# EAGLE board loa (EAGLE 5.11), part 1 of 2
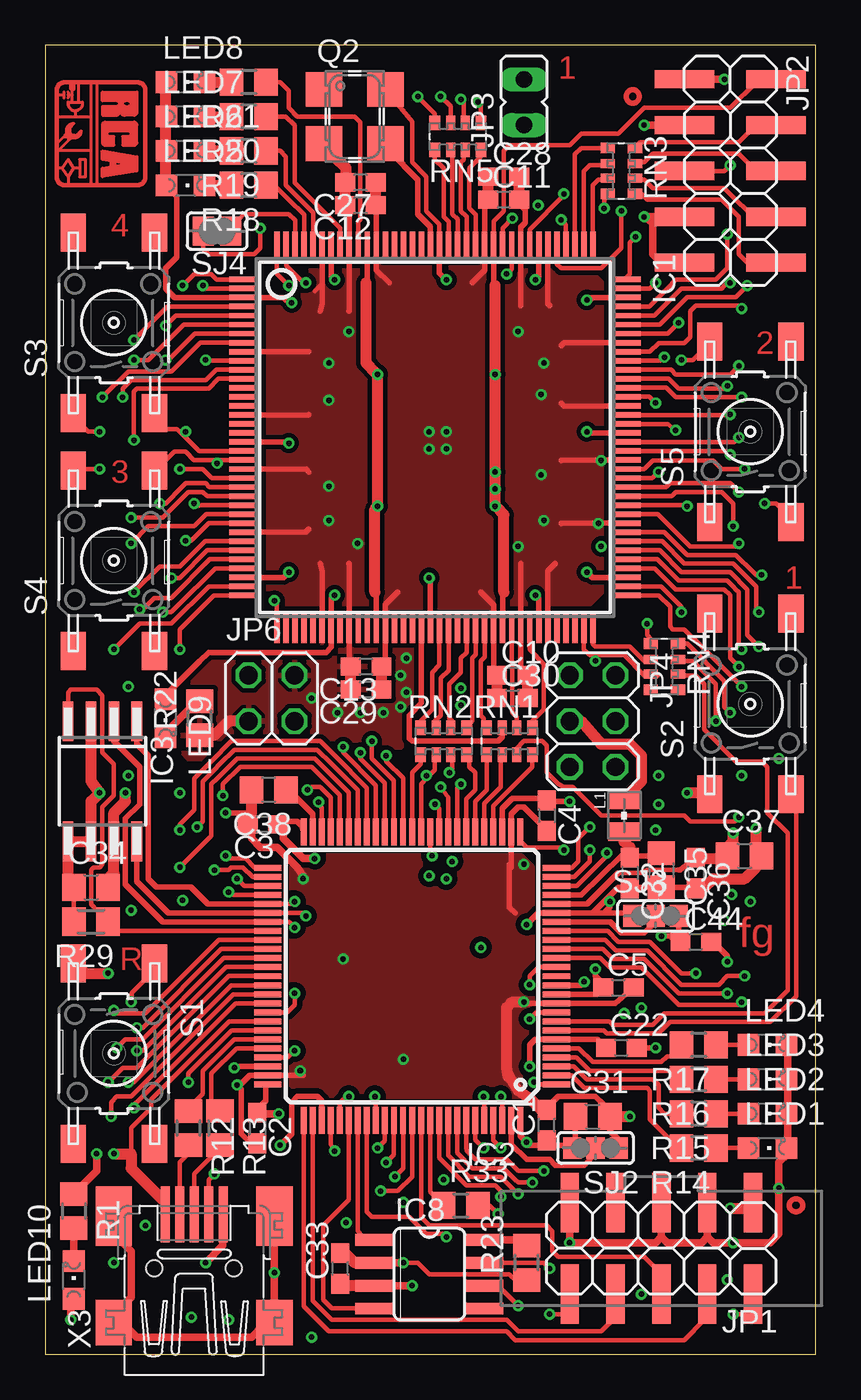
[diagram p7: board, top side]
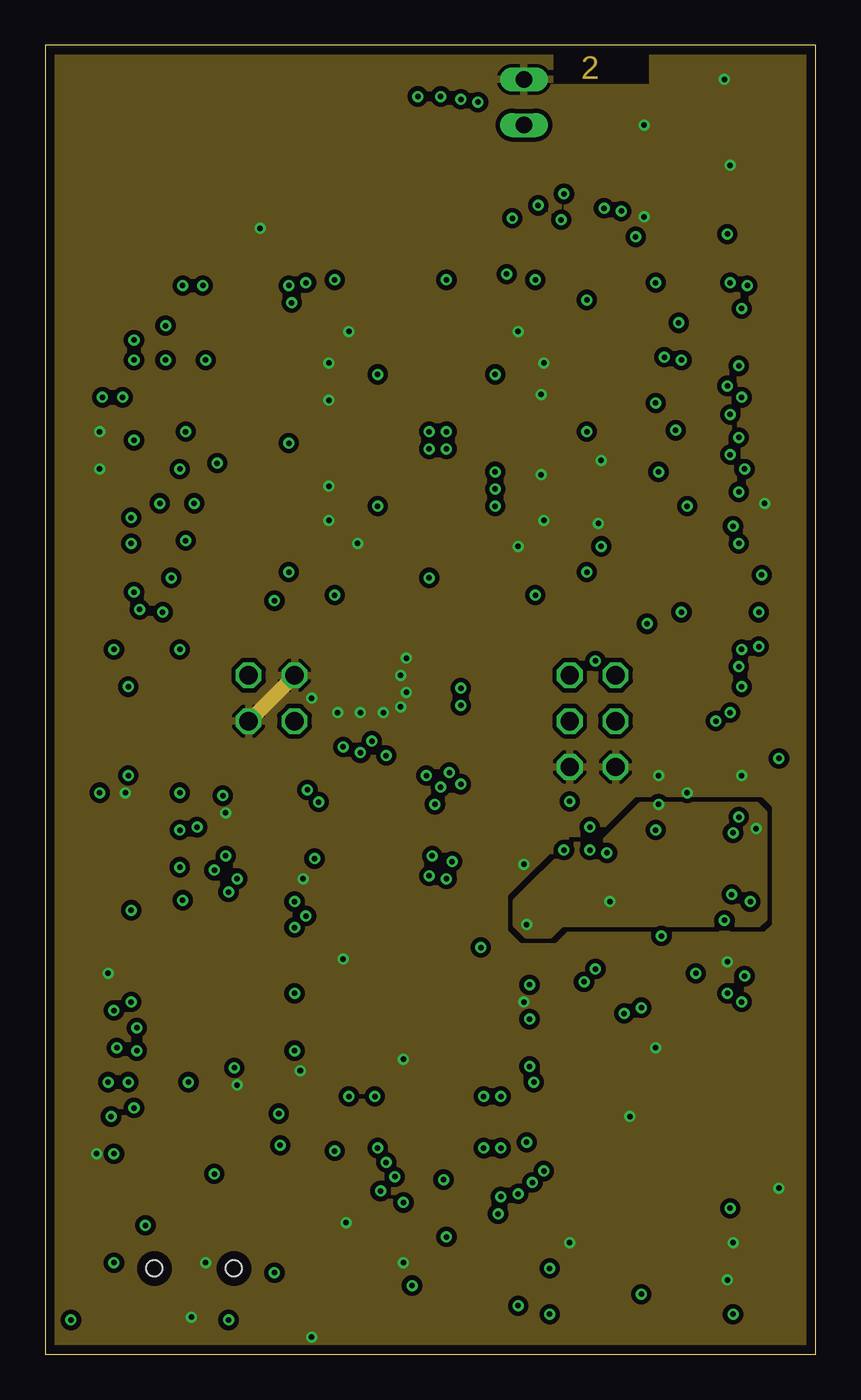
[diagram p8: board, inner layer GND]
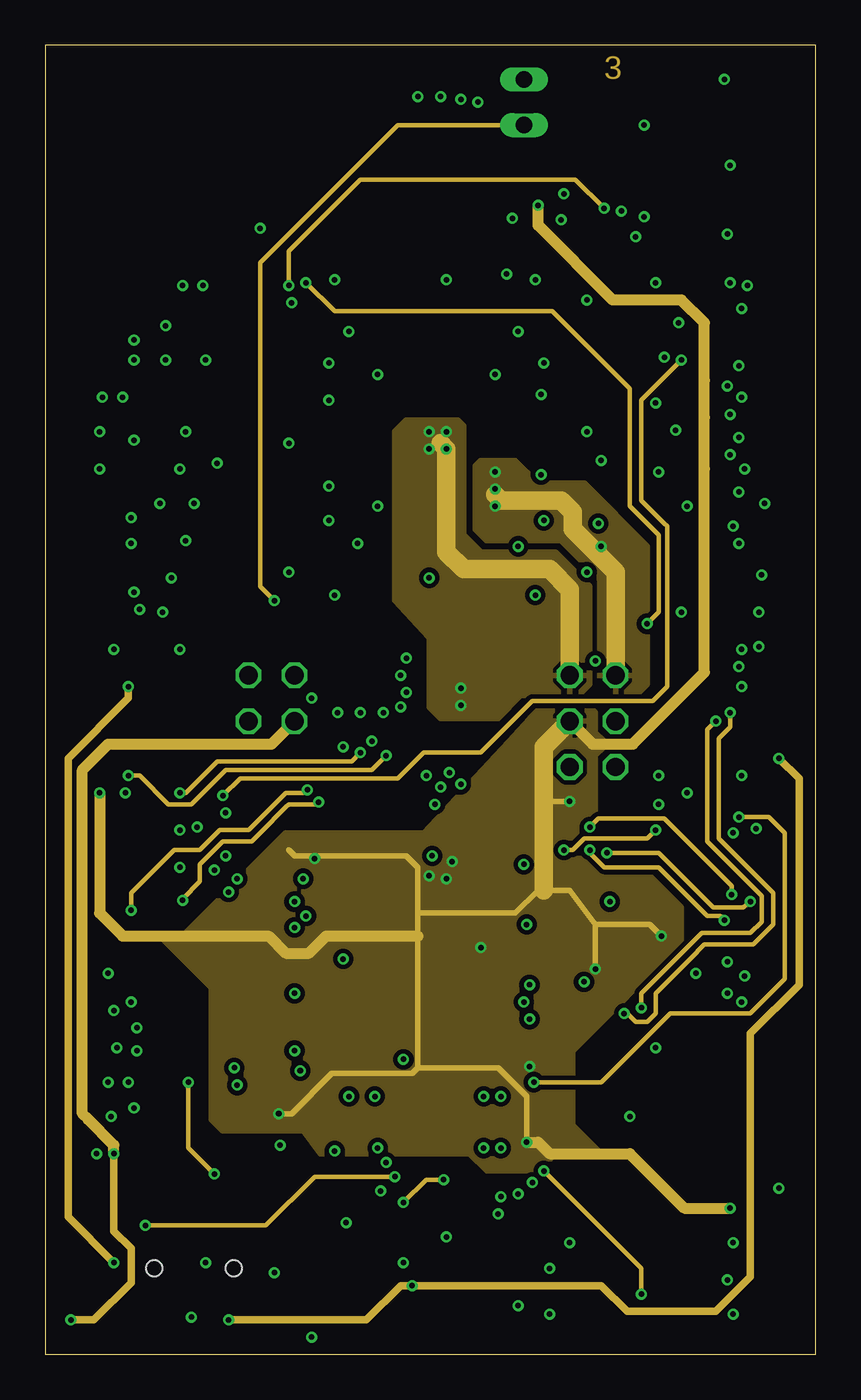
[diagram p9: board, inner layer Route15]
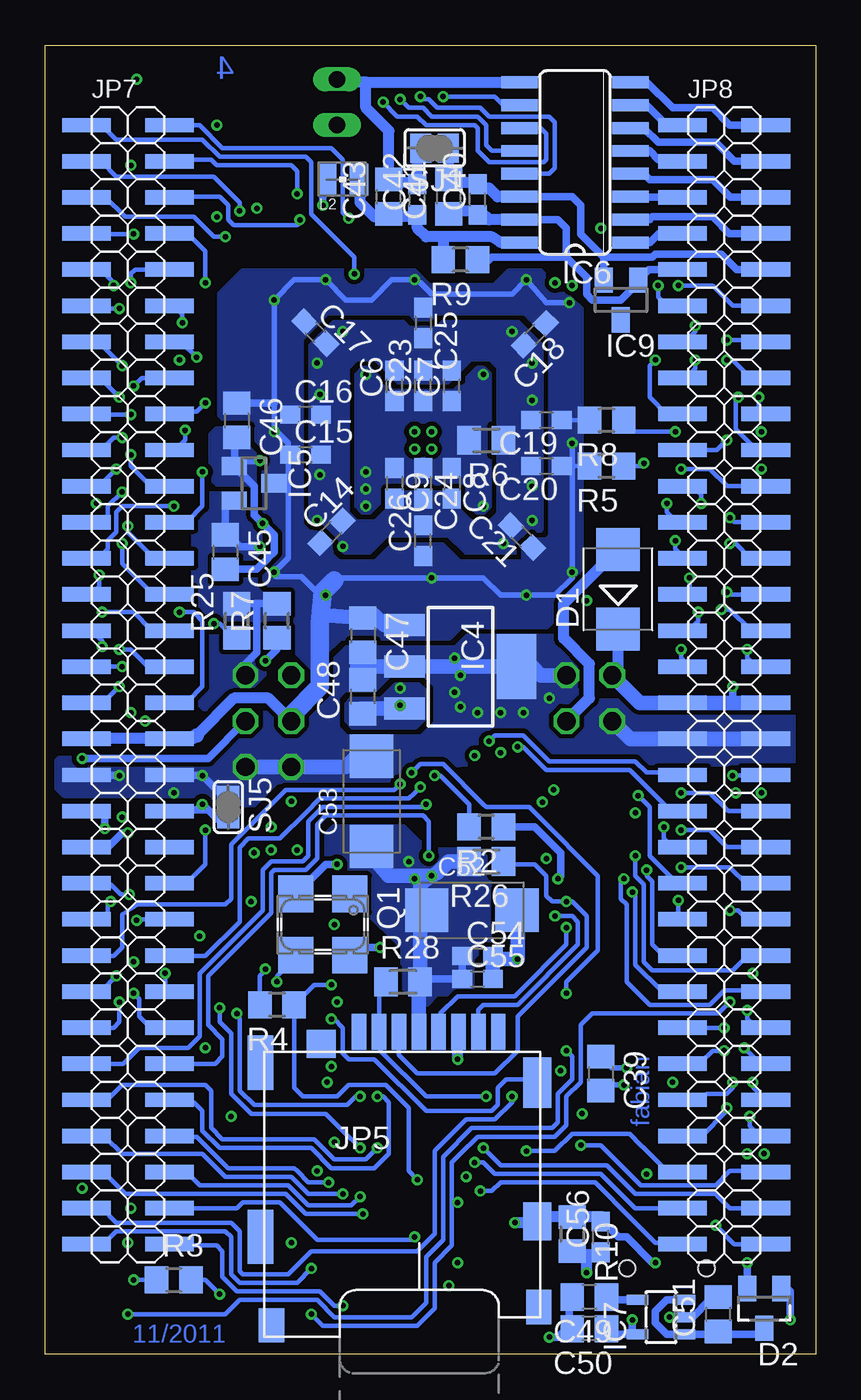
[diagram p10: board, bottom side, seen from below]

Size 42.68 x 72.54 mm. Coordinates in mm from the lower left corner, seen from the top.
Outline: 0,0 42.68,0 42.68,72.54 0,72.54 0,0
Copper layers (1+2*15+16): Top 0.035mm / dielectric 1.5mm / GND 0.035mm / dielectric 0.15mm / Route15 0.035mm / dielectric 0.2mm / Bottom 0.035mm
Design rules "PCB-POOL *": minimum track width 6mil, minimum drill 12mil, track to track 6mil, track to pad 6mil, pad to pad 6mil, via to via 6mil, smd to smd 6mil, copper to edge 20mil, drill to drill 8mil, minimum pad ring 8mil, minimum via ring 6mil, stop-mask expansion 12mil, vias tented up to drill 12mil, thermal gap 8mil

## Footprints (pad centres in the part's own frame; a part is rotated, then mirrored left to right if it is on the bottom)
C0603 = smd 1.1 x 1: 1 -0.85,0; 2 0.85,0
C0805 = smd 1.3 x 1.5: 1 -0.95,0; 2 0.95,0
SMC_C = smd 2.4 x 2.4: + -2.5,0; - 2.5,0
SMB = smd 2.4 x 2.4: A 2.2,0; C -2.2,0
SOT23 = smd 1 x 1.4: 1 -0.95,-1.1; 2 0.95,-1.1; 3 0,1.1
TQ144 = smd 0.3 x 1.6: 1 -8.75,-10.6; 2 -8.25,-10.6; 3 -7.75,-10.6; 4 -7.25,-10.6; 5 -6.75,-10.6; 6 -6.25,-10.6; 7 -5.75,-10.6; 8 -5.25,-10.6; 9 -4.75,-10.6; 10 -4.25,-10.6; 11 -3.75,-10.6; 12 -3.25,-10.6; 13 -2.75,-10.6; 14 -2.25,-10.6; 15 -1.75,-10.6; 16 -1.25,-10.6; 17 -0.75,-10.6; 18 -0.25,-10.6; 19 0.25,-10.6; 20 0.75,-10.6; 21 1.25,-10.6; 22 1.75,-10.6; 23 2.25,-10.6; 24 2.75,-10.6; 25 3.25,-10.6; 26 3.75,-10.6; 27 4.25,-10.6; 28 4.75,-10.6; 29 5.25,-10.6; 30 5.75,-10.6; 31 6.25,-10.6; 32 6.75,-10.6; 33 7.25,-10.6; 34 7.75,-10.6; 35 8.25,-10.6; 36 8.75,-10.6; 73 8.75,10.6; 74 8.25,10.6; 75 7.75,10.6; 76 7.25,10.6; 77 6.75,10.6; 78 6.25,10.6; 79 5.75,10.6; 80 5.25,10.6; 81 4.75,10.6; 82 4.25,10.6; 83 3.75,10.6; 84 3.25,10.6; 85 2.75,10.6; 86 2.25,10.6; 87 1.75,10.6; 88 1.25,10.6; 89 0.75,10.6; 90 0.25,10.6; 91 -0.25,10.6; 92 -0.75,10.6; 93 -1.25,10.6; 94 -1.75,10.6; 95 -2.25,10.6; 96 -2.75,10.6; 97 -3.25,10.6; 98 -3.75,10.6; 99 -4.25,10.6; 100 -4.75,10.6; 101 -5.25,10.6; 102 -5.75,10.6; 103 -6.25,10.6; 104 -6.75,10.6; 105 -7.25,10.6; 106 -7.75,10.6; 107 -8.25,10.6; 108 -8.75,10.6 | smd 1.6 x 0.3: 37 10.6,-8.75; 38 10.6,-8.25; 39 10.6,-7.75; 40 10.6,-7.25; 41 10.6,-6.75; 42 10.6,-6.25; 43 10.6,-5.75; 44 10.6,-5.25; 45 10.6,-4.75; 46 10.6,-4.25; 47 10.6,-3.75; 48 10.6,-3.25; 49 10.6,-2.75; 50 10.6,-2.25; 51 10.6,-1.75; 52 10.6,-1.25; 53 10.6,-0.75; 54 10.6,-0.25; 55 10.6,0.25; 56 10.6,0.75; 57 10.6,1.25; 58 10.6,1.75; 59 10.6,2.25; 60 10.6,2.75; 61 10.6,3.25; 62 10.6,3.75; 63 10.6,4.25; 64 10.6,4.75; 65 10.6,5.25; 66 10.6,5.75; 67 10.6,6.25; 68 10.6,6.75; 69 10.6,7.25; 70 10.6,7.75; 71 10.6,8.25; 72 10.6,8.75; 109 -10.6,8.75; 110 -10.6,8.25; 111 -10.6,7.75; 112 -10.6,7.25; 113 -10.6,6.75; 114 -10.6,6.25; 115 -10.6,5.75; 116 -10.6,5.25; 117 -10.6,4.75; 118 -10.6,4.25; 119 -10.6,3.75; 120 -10.6,3.25; 121 -10.6,2.75; 122 -10.6,2.25; 123 -10.6,1.75; 124 -10.6,1.25; 125 -10.6,0.75; 126 -10.6,0.25; 127 -10.6,-0.25; 128 -10.6,-0.75; 129 -10.6,-1.25; 130 -10.6,-1.75; 131 -10.6,-2.25; 132 -10.6,-2.75; 133 -10.6,-3.25; 134 -10.6,-3.75; 135 -10.6,-4.25; 136 -10.6,-4.75; 137 -10.6,-5.25; 138 -10.6,-5.75; 139 -10.6,-6.25; 140 -10.6,-6.75; 141 -10.6,-7.25; 142 -10.6,-7.75; 143 -10.6,-8.25; 144 -10.6,-8.75
TQFP100 = smd 1.5 x 0.33: 1 -8,6; 2 -8,5.5; 3 -8,5; 4 -8,4.5; 5 -8,4; 6 -8,3.5; 7 -8,3; 8 -8,2.5; 9 -8,2; 10 -8,1.5; 11 -8,1; 12 -8,0.5; 13 -8,0; 14 -8,-0.5; 15 -8,-1; 16 -8,-1.5; 17 -8,-2; 18 -8,-2.5; 19 -8,-3; 20 -8,-3.5; 21 -8,-4; 22 -8,-4.5; 23 -8,-5; 24 -8,-5.5; 25 -8,-6; 51 8,-6; 52 8,-5.5; 53 8,-5; 54 8,-4.5; 55 8,-4; 56 8,-3.5; 57 8,-3; 58 8,-2.5; 59 8,-2; 60 8,-1.5; 61 8,-1; 62 8,-0.5; 63 8,0; 64 8,0.5; 65 8,1; 66 8,1.5; 67 8,2; 68 8,2.5; 69 8,3; 70 8,3.5; 71 8,4; 72 8,4.5; 73 8,5; 74 8,5.5; 75 8,6 | smd 0.33 x 1.5: 26 -6,-8; 27 -5.5,-8; 28 -5,-8; 29 -4.5,-8; 30 -4,-8; 31 -3.5,-8; 32 -3,-8; 33 -2.5,-8; 34 -2,-8; 35 -1.5,-8; 36 -1,-8; 37 -0.5,-8; 38 0,-8; 39 0.5,-8; 40 1,-8; 41 1.5,-8; 42 2,-8; 43 2.5,-8; 44 3,-8; 45 3.5,-8; 46 4,-8; 47 4.5,-8; 48 5,-8; 49 5.5,-8; 50 6,-8; 76 6,8; 77 5.5,8; 78 5,8; 79 4.5,8; 80 4,8; 81 3.5,8; 82 3,8; 83 2.5,8; 84 2,8; 85 1.5,8; 86 1,8; 87 0.5,8; 88 0,8; 89 -0.5,8; 90 -1,8; 91 -1.5,8; 92 -2,8; 93 -2.5,8; 94 -3,8; 95 -3.5,8; 96 -4,8; 97 -4.5,8; 98 -5,8; 99 -5.5,8; 100 -6,8
SO-08M = smd 0.6 x 2.2: 1 -1.905,-3.33; 2 -0.635,-3.33; 3 0.635,-3.33; 4 1.905,-3.33; 5 1.905,3.33; 6 0.635,3.33; 7 -0.635,3.33; 8 -1.905,3.33
SOT223 = smd 1.219 x 2.235: 1 -2.311,-3.099; 2 0,-3.099; 3 2.311,-3.099 | smd 3.6 x 2.2: 4 0,3.099
SO16 = smd 0.66 x 2.032: 1 -4.445,-3.073; 2 -3.175,-3.073; 3 -1.905,-3.073; 4 -0.635,-3.073; 5 0.635,-3.073; 6 1.905,-3.073; 7 3.175,-3.073; 8 4.445,-3.073; 9 4.445,3.073; 10 3.175,3.073; 11 1.905,3.073; 12 0.635,3.073; 13 -0.635,3.073; 14 -1.905,3.073; 15 -3.175,3.073; 16 -4.445,3.073
SOT23-5L = smd 0.55 x 1.2: 1 -0.95,-1.3; 2 0,-1.3; 3 0.95,-1.3; 4 0.95,1.3; 5 -0.95,1.3
SOIC-8 = smd 2.032 x 0.66: 1 -3.073,1.27; 2 -3.073,0; 3 -3.073,-1.27; 4 -3.073,-2.54; 5 3.073,-2.54; 6 3.073,-1.27; 7 3.073,0; 8 3.073,1.27
2X05SMD = smd 1.016 x 3.302: 1 -5.08,-2.54; 2 -5.08,2.54; 3 -2.54,-2.54; 4 -2.54,2.54; 5 0,-2.54; 6 0,2.54; 7 2.54,-2.54; 8 2.54,2.54; 9 5.08,-2.54; 10 5.08,2.54
2X05SMD' = smd 1.016 x 3.302: 1 -1.27,-3.81; 2 -1.27,1.27; 3 1.27,-3.81; 4 1.27,1.27; 5 3.81,-3.81; 6 3.81,1.27; 7 6.35,-3.81; 8 6.35,1.27; 9 8.89,-3.81; 10 8.89,1.27
JP1 = drill 0.914 long: 1 0,-1.27; 2 0,1.27
2X03 = drill 1.016 octagon: 1 -2.54,-1.27; 2 -2.54,1.27; 3 0,-1.27; 4 0,1.27; 5 2.54,-1.27; 6 2.54,1.27
SD_MOLEX_49225-0821 = smd 0.8 x 2: 1 -2.43,8.5; 2 -1.33,8.5; 3 -0.23,8.5; 4 0.87,8.5; 5 1.97,8.5; 6 3.07,8.5; 7 4.17,8.5; 8 5.27,8.5 | smd 1.4 x 1.9: 11 7.51,-6.75; 12 -7.29,-7.75 | smd 1.4 x 3: 13 -7.89,-2.85; 14 -7.89,6.8 | smd 1.6 x 1.55: 15 -4.53,7.825 | smd 1.55 x 2.8: SW1 7.435,5.7 | smd 1.55 x 2.1: SW2 7.435,-2
2X02 = drill 1.016 octagon: 1 -1.27,-1.27; 2 -1.27,1.27; 3 1.27,-1.27; 4 1.27,1.27
2X32M_SMD = smd 0.8 x 2.7: 1 -30,-2.3; 2 -30,2.3; 3 -28,-2.3; 4 -28,2.3; 5 -26,-2.3; 6 -26,2.3; 7 -24,-2.3; 8 -24,2.3; 9 -22,-2.3; 10 -22,2.3; 11 -20,-2.3; 12 -20,2.3; 13 -18,-2.3; 14 -18,2.3; 15 -16,-2.3; 16 -16,2.3; 17 -14,-2.3; 18 -14,2.3; 19 -12,-2.3; 20 -12,2.3; 21 -10,-2.3; 22 -10,2.3; 23 -8,-2.3; 24 -8,2.3; 25 -6,-2.3; 26 -6,2.3; 27 -4,-2.3; 28 -4,2.3; 29 -2,-2.3; 30 -2,2.3; 31 0,-2.3; 32 0,2.3; 33 2,-2.3; 34 2,2.3; 35 4,-2.3; 36 4,2.3; 37 6,-2.3; 38 6,2.3; 39 8,-2.3; 40 8,2.3; 41 10,-2.3; 42 10,2.3; 43 12,-2.3; 44 12,2.3; 45 14,-2.3; 46 14,2.3; 47 16,-2.3; 48 16,2.3; 49 18,-2.3; 50 18,2.3; 51 20,-2.3; 52 20,2.3; 53 22,-2.3; 54 22,2.3; 55 24,-2.3; 56 24,2.3; 57 26,-2.3; 58 26,2.3; 59 28,-2.3; 60 28,2.3; 61 30,-2.3; 62 30,2.3; 63 32,-2.3; 64 32,2.3
WE-KI_0805_B = smd 1.02 x 1.78: 1 -0.89,0; 2 0.89,0
CHIPLED_0805 = smd 1.2 x 1.2: A 0,-1.05; C 0,1.05
XO53 = smd 1.93 x 2.032: 1 -1.5,-1.7; 2 1.5,-1.7; 3 1.5,1.7; 4 -1.5,1.7
R0805 = smd 1.3 x 1.5: 1 -0.95,0; 2 0.95,0
M0805 = smd 1.3 x 1.6: 1 -0.95,0; 2 0.95,0
EXB38V = smd 0.6 x 0.8: 1 -1.275,-0.75; 4 1.275,-0.75; 5 1.275,0.75; 8 -1.275,0.75 | smd 0.5 x 0.8: 2 -0.4,-0.75; 3 0.4,-0.75; 6 0.4,0.75; 7 -0.4,0.75
B3F-10XX-SMD = smd 2.1 x 1.4: P1 -5,2.25; P2 5,2.25; P3 -5,-2.25; P4 5,-2.25
SJ = smd 1.168 x 1.6: 1 -0.762,0; 2 0.762,0
SJ_2S = smd 1 x 1.2: 1 -1.286,0; 2 0,0; 3 1.286,0
SJS = smd 1 x 1.2: 1 -0.683,0; 2 0.683,0
32005-201 = smd 3.1 x 0.5: 1 3,1.6; 2 3,0.8; 3 3,0; 4 3,-0.8; 5 3,-1.6 | smd 2.5 x 2: M1 -3,-4.45; M2 -3,4.45 | smd 3.3 x 2: M3 2.9,4.45; M4 2.9,-4.45 | hole 0.9: 0,2.2; 0,-2.2

## Placement (x,y rotation side)
C1  100n  [C0603]  27.78,12.7 90 top
C2  100n  [C0603]  11.75,12.54 270 top
C3  100n  [C0603]  12.06,29.37 180 top
C4  100n  [C0603]  27.78,29.84 270 top
C5  100n  [C0603]  31.75,20.32 0 top
C6  100n  [C0603]  23.34,53.66 90 bottom
C7  100n  [C0603]  20.16,53.66 90 bottom
C8  100n  [C0603]  20.16,48.26 270 bottom
C9  100n  [C0603]  23.34,48.26 270 bottom
C10  10n  [C0603]  25.88,37.62 0 top
C11  10n  [C0603]  25.4,63.98 0 top
C12  10n  [C0603]  17.46,63.66 180 top
C13  10n  [C0603]  17.78,38.1 180 top
C14  100n  [C0603]  26.83,45.56 45 bottom
C15  100n  [C0603]  28.26,49.85 0 bottom
C16  100n  [C0603]  28.26,52.07 0 bottom
C17  100n  [C0603]  27.72,56.61 315 bottom
C18  100n  [C0603]  15.56,56.52 225 bottom
C19  100n  [C0603]  14.92,51.75 180 bottom
C20  100n  [C0603]  14.92,49.21 180 bottom
C21  100n  [C0603]  16.29,45.31 135 bottom
C22  100n  [C0603]  31.91,16.99 0 top
C23  10n  [C0603]  21.75,53.66 90 bottom
C24  10n  [C0603]  21.75,48.26 270 bottom
C25  100n  [C0603]  21.75,57.15 270 bottom
C26  100n  [C0603]  21.75,45.09 90 bottom
C27  100n  [C0603]  17.46,64.93 180 top
C28  100n  [C0603]  25.4,65.25 0 top
C29  100n  [C0603]  17.78,36.83 180 top
C30  100n  [C0603]  25.88,36.35 0 top
C31  4u7  [C0805]  30.32,13.18 0 top
C32  1n  [C0603]  32.38,26.67 270 top
C33  100n  [C0603]  16.35,4.76 90 top
C34  100n  [C0805]  2.54,25.88 0 top
C35  1µ  [C0805]  34.13,26.83 270 top
C36  1n  [C0603]  36.04,26.67 270 top
C37  1µ  [C0805]  38.73,27.62 0 top
C38  2u2  [C0805]  12.38,31.27 180 top
C39  2u2  [C0805]  11.91,15.56 270 bottom
C40  1n  [C0603]  18.73,63.98 90 bottom
C41  1µ  [C0805]  20.32,64.13 90 bottom
C42  1n  [C0603]  22.07,63.98 90 bottom
C43  1µ  [C0805]  23.65,64.14 90 bottom
C44  100n  [C0603]  36.04,22.86 0 top
C45  1µ  [C0805]  32.7,44.45 270 bottom
C46  1µ  [C0805]  32.07,51.75 270 bottom
C47  4µ7  [C0805]  25.08,39.85 270 bottom
C48  1µ  [C0805]  25.08,36.43 90 bottom
C49  N.B.  [C0805]  12.54,3.17 180 bottom
C50  2µ2  [C0805]  12.54,1.43 180 bottom
C51  1µ  [C0805]  5.4,2.22 90 bottom
C52  22µ  [SMC_C]  19.05,24.61 0 bottom
C53  22µ  [SMC_C]  24.61,30.64 90 bottom
C54  100n  [C0603]  18.73,22.07 0 bottom
C55  100n  [C0603]  18.73,20.8 0 bottom
C56  10n  [C0603]  11.91,6.51 90 bottom
D1  MURS 140  [SMB]  10.95,42.39 90 bottom
D2  BAT54C  [SOT23]  2.86,2.54 180 bottom
IC1  XC3S200-4TQ144  [TQ144]  21.59,50.8 270 top
IC2  STM32F10XVXT6  [TQFP100]  20.32,20.95 180 top
IC3  AT45DB081D-SU  [SO-08M]  3.17,31.75 180 top
IC4  MCP1825S-1202E/DB  [SOT223]  19.68,38.1 270 bottom
IC5  MCP1700  [SOT23]  31.11,48.26 270 bottom
IC6  MCP3008SL  [SO16]  13.34,66.04 90 bottom
IC7  MIC5205  [SOT23-5L]  8.57,2.06 90 bottom
IC8  MCP2551SN  [SOIC-8]  21.27,5.08 0 top
IC9  LM4040-2.5  [SOT23]  10.79,58.42 180 bottom
JP1  CORTEX_JTAGS  [2X05SMD]  34.13,5.87 180 top
JP2  FPGA JTAG  [2X05SMD']  39.21,69.37 270 top
JP3  JTAG Mode  [JP1]  26.51,69.37 0 top
JP4  Power In  [2X03]  30.32,35.08 270 top
JP5  SD_DETECT  [SD_MOLEX_49225-0821]  22.86,9.37 0 bottom
JP6  Power Ext  [2X02]  12.54,36.35 0 top
JP7  right  [2X32M_SMD]  38.1,38.1 270 bottom
JP8  left  [2X32M_SMD]  5.08,38.1 270 bottom
L1  0,68u  [WE-KI_0805_B]  32.07,29.84 270 top
L2  0,68u  [WE-KI_0805_B]  26.19,65.09 0 bottom
LED1  Red  [CHIPLED_0805]  40.01,11.43 270 top
LED2  Red  [CHIPLED_0805]  40.01,13.34 270 top
LED3  Red  [CHIPLED_0805]  40.01,15.24 270 top
LED4  Red  [CHIPLED_0805]  40.01,17.14 270 top
LED5  Red  [CHIPLED_0805]  7.78,64.77 270 top
LED6  Red  [CHIPLED_0805]  7.78,66.67 270 top
LED7  Red  [CHIPLED_0805]  7.78,68.58 270 top
LED8  Red  [CHIPLED_0805]  7.78,70.48 270 top
LED9  Green  [CHIPLED_0805]  6.67,35.24 180 top
LED10  Blue  [CHIPLED_0805]  1.59,4.13 0 top
Q1  25.000  [XO53]  27.3,23.81 180 bottom
Q2  50.000  [XO53]  17.14,68.58 270 top
R1  820  [R0805]  1.59,7.94 270 top
R2  100k  [R0805]  18.26,29.21 180 bottom
R3  100k  [R0805]  35.56,4.13 0 bottom
R4  10k  [R0805]  29.84,19.37 180 bottom
R5  10k  [R0805]  11.59,49.21 180 bottom
R6  120  [M0805]  18.26,50.64 180 bottom
R7  4k7  [R0805]  29.84,40.64 90 bottom
R8  10k  [R0805]  11.59,51.75 180 bottom
R9  820  [R0805]  19.68,60.64 180 bottom
R10  1M  [R0805]  13.49,6.67 270 bottom
R12  22  [R0805]  7.94,12.54 270 top
R13  22  [R0805]  9.68,12.54 270 top
R14  470  [R0805]  36.2,11.43 180 top
R15  470  [R0805]  36.2,13.34 180 top
R16  470  [R0805]  36.2,15.24 180 top
R17  470  [R0805]  36.2,17.14 180 top
R18  470  [R0805]  11.27,64.77 180 top
R19  470  [R0805]  11.27,66.67 180 top
R20  470  [R0805]  11.27,68.58 180 top
R21  470  [R0805]  11.27,70.48 180 top
R22  330  [R0805]  8.57,35.24 90 top
R23  470  [R0805]  26.67,5.08 90 top
R25  4k7  [R0805]  32.07,40.64 90 bottom
R26  10k  [M0805]  18.26,27.3 180 bottom
R28  10k  [M0805]  22.86,20.64 0 bottom
R29  10k  [M0805]  2.54,23.97 180 top
R33  120  [R0805]  23.02,8.26 0 top
RN1  33  [EXB38V]  25.72,33.97 0 top
RN2  33  [EXB38V]  22.07,33.97 0 top
RN3  33  [EXB38V]  31.91,65.56 270 top
RN4  100  [EXB38V]  34.29,38.1 270 top
RN5  33  [EXB38V]  22.86,67.47 180 top
S1  Reset  [B3F-10XX-SMD]  3.81,16.67 270 top
S2  Button 1  [B3F-10XX-SMD]  39.05,36.04 90 top
S3  Button 4  [B3F-10XX-SMD]  3.81,57.15 90 top
S4  Button 3  [B3F-10XX-SMD]  3.81,43.97 90 top
S5  Button 2  [B3F-10XX-SMD]  39.05,51.12 90 top
SJ1  [SJ]  21.11,66.83 180 bottom
SJ2  [SJ_2S]  30.48,11.43 180 top
SJ3  [SJ_2S]  33.81,24.29 0 top
SJ4  [SJ]  9.53,62.23 180 top
SJ5  [SJS]  32.54,30.32 270 bottom
U$1  [LOGO]  3.17,67.63 270 top
X3  MINI-USB  [32005-201]  8.25,4.76 90 top

## Tracks (layer width: path | path; a pad name or v marks a point on that pad's centre or on a via)
!RESET  (via drill 0.3)
  Top 0.254: IC2.14 27.33,21.45 26.83,20.95 v26.83,20.48 | S1.P1 6.03,21.27 4.79,20.03 4.79,19.55 v4.76,19.53 | v27.94,2.22 28.73,2.22 29.05,2.54 JP1.10 | JP1.10
  Route15 0.254: v22.07,9.68 21.11,9.68 v19.84,8.41
  Bottom 0.254: v26.83,20.48 | v26.83,20.48 27.15,20.48 27.46,20.48 27.78,20.48 R4.1 | R4.1 | v4.76,19.53 5.24,19.05 | 5.24,19.05 5.4,18.89 12.38,18.89 13.02,18.26 13.02,15.08 13.81,14.29 13.81,12.7 14.45,12.06 18.73,12.06 19.68,11.11 | 5.24,19.05 | 19.68,11.11 | 19.68,11.11 20.16,10.64 20.16,8.41 | 20.16,8.41 20.16,6.03 21.11,5.08 21.11,2.54 22.07,1.59 27.3,1.59 v27.94,2.22 | R4.1 28.89,14.76 28.42,14.29 26.51,14.29 25.88,14.92 23.81,14.92 22.54,13.65 22.54,10.16 v22.07,9.68 | 20.16,8.41 v19.84,8.41
+2V5  (via drill 0.3)
  Top 0.254: IC1.120 24.84,62.78 25.4,63.34 25.4,66.67 25.72,66.99 29.05,66.99 29.69,67.63 31.75,67.63 33.18,69.06 37.94,69.06 39.37,70.48 40.32,70.48 JP2.2
  Top 0.305: 24.92,59.21 24.84,59.3 IC1.120 | v24.92,54.29 25,54.22 | 17.78,59.37 17.84,59.43 IC1.134 | v18.41,54.29 18.32,54.35 | IC1.62 25.34,42.13 25.4,42.23 | IC1.48 18.34,41.99 18.26,42.23 | v18.41,46.99 18.57,46.99 18.34,46.91 v18.41,46.99
  Top 0.61: 24.92,59.21 v24.92,54.29 v24.92,47.94 v24.92,46.99 25.18,46.77 25.4,46.51 25.4,42.23 | 18.32,54.35 17.78,54.93 17.78,59.37 | 18.26,42.23 18.26,46.83 v18.41,46.99 v18.41,54.29
  Route15 1.016: JP4.2 31.59,43.34 29.21,45.72 29.21,46.67 28.57,47.31 25.24,47.31 24.92,47.62
  Bottom 0.406: JP4.2 31.59,38.26 30.96,38.89 30.96,41.59 | 30.96,41.59 R7.2 | R25.2 31.59,41.59 30.96,41.59 | C45.1 32.7,46.82 IC5.2 | v30.8,44.77 31.91,44.77 32.23,45.09 32.38,45.09 C45.1
  other vias: 24.92,48.9
  pour Bottom (isolate 0.254, no thermals): 18.1,46.99 18.41,46.67 18.73,46.67 20,47.94 23.5,47.94 24.77,46.67 25.08,46.67 25.4,46.99 25.4,54.29 25.08,54.61 24.77,54.61 23.5,53.34 20,53.34 18.73,54.61 18.41,54.61 18.1,54.29
  pour Route15 (isolate 0.254, rank 2): 23.81,45.4 23.81,49.21 24.13,49.53 26.04,49.53 27.3,48.26 29.84,48.26 33.34,44.77 33.34,37.15 32.7,36.51 31.27,36.51 30.64,37.15 30.64,43.02 28.57,45.09 24.13,45.09
  pour Bottom (isolate 0.254, rank 5, no thermals): 30.8,43.18 30.8,45.88 31.43,46.51 31.43,47.47 31.75,47.78 33.97,47.78 34.45,47.31 34.45,36.35 33.81,35.72 32.54,35.72 30.8,37.47 30.8,37.47 28.89,39.37 28.89,41.27
+3V3  (via drill 0.3)
  Top 0.254: IC1.126 21.84,62.62 21.11,63.34 21.11,65.25 21.05,65.31 | 21.05,65.31 | 21.05,65.31 20.32,66.04 20.32,68.29 Q2.4 | R29.2 1.59,24.29 C34.1
  Top 0.305: IC2.11 30.54,19.95 C5.1 30.8,20.32 30.8,20.64 30.48,20.95 v30.48,21.35 | IC1.115 27.34,59.73 v27.15,59.53 | IC1.106 30.29,58.55 30.16,58.42 30.13,58.55 v30,58.42 | IC1.91 30.07,51.05 v30,51.12 | IC1.75 30.29,43.05 30.16,43.18 29.87,43.37 v30,43.34 | IC1.66 27.34,41.88 v27.15,42.07 | IC1.54 21.34,42.8 v21.27,43.02 | v16.03,42.07 15.84,41.88 IC1.43 15.84,39.18 15.56,38.89 9.68,38.89 9.53,38.89 9.05,38.89 8.57,38.42 7.46,37.31 6.83,36.67 | v13.65,58.26 13.62,58.23 13.34,58.42 13.21,58.55 IC1.3 7.17,58.55 6.67,59.05 6.67,60.17 7.3,60.8 7.3,64.14 LED5.A | IC1.138 15.84,59.73 v16.03,59.53 | IC1.126 21.84,59.92 v22.23,59.53 | IC1.19 13.43,50.55 v13.49,50.48 | IC1.34 13.21,43.05 13.34,43.18 13.46,43.37 v13.49,43.34 | IC2.50 14.22,29.27 13.97,29.53 13.18,29.53 C3.1 | C2.1 11.75,13.57 12.22,14.05 12.22,14.86 IC2.75 | IC2.28 25.32,30.24 25.88,30.8 27.68,30.8 C4.1 27.78,30.8 27.94,30.64 v29.05,30.64 | C22.1 30.59,17.45 IC2.6 27.14,17.45 26.83,17.14 v26.83,15.95 | IC2.100 26.32,12.1 v26.67,11.75 26.83,11.59 27.46,11.59 27.73,11.85 C1.1 27.78,11.59 | 27.78,11.59 | 27.78,11.59 29.04,11.59 | 29.04,11.59 SJ2.3 | 29.04,11.59 29.37,11.59 C31.1 | SJ3.3 35.08,24.29 35.08,22.96 C44.1 35.03,23.02 34.77,23.02 34.61,23.18 v34.13,23.18
  Top 0.406: 11.91,13.34 C2.1 | 11.91,13.34 | v12.94,13.34 11.91,13.34 | v14.92,27.46 14.29,27.46 13.18,28.57 13.18,29.21 | 13.18,29.21 | 13.18,29.21 C3.1 | C3.1 | LED9.A 6.73,36.35 6.83,36.35 6.83,36.67
  Top 0.61: v3.02,31.11 2.54,30.64 IC3.6 IC3.5 1.27,26.51 1.43,26.35 C34.1 | v3.02,31.11 | v3.02,31.11 2.54,31.75 IC3.3 | JP1.1 | JP1.1 38.89,8.1 v37.94,8.1 | L1.1 31.5,30.73 32.23,30.96 32.38,31.11 33.02,31.75 33.02,33.18 32.38,33.81 30.8,33.81 29.69,35.08 JP4.3 | 6.83,70.48 LED8.A 6.67,70.48 6.67,68.64 LED7.A 6.67,68.58 | 6.67,68.58 6.51,68.58 | 6.67,68.58 6.67,66.74 LED6.A 6.67,66.67 6.67,64.83 LED5.A
  Route15 0.305: 20.64,15.88 25.08,15.88 26.67,14.29 v26.67,11.75 | v29.05,30.64 27.62,30.64 | 30.48,23.81 29.05,25.72 27.62,25.72 27.3,25.72 26.04,24.45 20.64,24.45 | 30.48,23.81 v30.48,21.35 | 20.64,15.88 20.64,23.18 20.64,24.45 | 20.64,24.45 20.64,26.99 20,27.62 13.81,27.62 13.49,27.94 | 30.48,23.81 33.5,23.81 33.81,23.5 v34.13,23.18 | 20.64,15.88 20.32,15.56 15.88,15.56 13.65,13.34 v12.94,13.34
  Route15 0.61: v3.02,31.11 3.02,24.45 4.29,23.18 12.38,23.18 13.34,22.23 14.61,22.23 15.56,23.18 20.64,23.18 | v37.94,8.1 35.4,8.1 32.38,11.11 27.94,11.11 27.3,11.75 v26.67,11.75 | 29.21,35.08 29.21,34.92 30.32,33.81 32.54,33.81 36.51,37.78 36.51,49.05 36.51,51.91 36.51,53.98 36.51,57.15 35.24,58.42 31.43,58.42 27.3,62.55 v27.3,63.66
  Route15 1.016: JP4.3 | JP4.3 27.62,33.66 27.62,25.72
  Bottom 0.254: R4.2 30.8,20.95 30.48,21.27 v30.48,21.35 | R8.2 C19.1 | R5.2 C20.1 | JP4.3 29.21,35.08
  Bottom 0.305: v16.03,59.53 16.83,58.74 21.27,58.74 21.91,59.37 v22.23,59.53 23.5,59.53 24.61,58.42 26.04,58.42 v27.15,59.53 | v27.15,59.53 | v27.15,59.53 28.89,59.53 v30,58.42 30,52.7 v30,51.12 29.84,51.12 29.21,50.48 29.21,48.1 29.21,47.15 29.21,46.2 29.21,44.13 v30,43.34 30,43.18 | v27.15,42.07 27.46,42.07 28.42,43.02 28.5,43.1 29.92,43.1 30,43.18 | 30,43.18 | v27.15,42.07 26.19,43.02 v21.27,43.02 18.41,43.02 17.46,42.07 17.3,42.07 v16.03,42.07 14.45,42.07 13.49,43.02 v13.49,43.34 v13.49,50.48 | v27.15,42.07 | v16.03,59.53 | v16.03,59.53 14.92,58.26 v13.65,58.26 | 21.91,23.81 C52.+
  Bottom 0.406: Q1.4 25.67,22.11 25.24,22.54 v24.13,22.54 | L2.1 27.15,64.93 27.3,64.77 v27.3,63.66 | C46.1 30.01,52.7 30,52.7 | 19.68,20.8 C55.1 | 19.68,20.8 19.68,20.95 19.58,20.95 C54.1 19.68,22.07 | 19.68,20.8 21.91,20.8 R28.2
  Bottom 0.61: JP4.3 30.32,36.35 32.23,36.35 34.29,34.29 34.45,34.13 35.77,34.13 JP7.36 35.85,34.1 35.88,34.13 40.37,34.13 JP7.35
  Bottom 0.813: JP5.4 21.99,20.56 R28.2 21.91,23.81 21.91,26.04 | 21.91,26.04 v21.27,26.51 | R26.2 20.32,27.3 20.95,26.67 v21.27,26.51 | JP4.3 | 21.91,26.04 21.91,24.45 | JP4.3 | IC4.1 23.9,40.41 24.45,40.96 25.4,40.96 C47.1 27.3,40.95 27.46,40.48 | C53.+ 24.61,27.62 23.65,26.51 v21.27,26.51 | 34.29,34.29
  Bottom 1.016: JP4.3 29.05,35.4 27.46,36.99 27.46,40.48 27.3,42.23 26.67,42.86
  other vias: 22.22,26.35 22.54,27.3
  pour Bottom (isolate 0.254, rank 3, no thermals): 13.02,57.94 15.24,60.01 16.99,60.01 17.78,59.21 21.43,59.21 22.23,60.01 31.75,60.01 33.02,58.74 33.02,52.07 31.43,50.48 31.43,49.21 30.48,48.26 30.48,42.86 28.89,41.27 28.89,39.05 27.62,37.78 27.3,37.78 27.3,38.73 26.35,39.69 20.32,39.69 19.68,40.32 14.92,40.32 14.29,40.96 14.29,41.59 13.02,42.86
  pour Route15 (isolate 0.254, rank 2): 9.21,13.02 9.84,12.38 14.29,12.38 15.24,11.11 23.5,11.11 24.45,10.16 27.3,10.16 28.26,11.11 30.8,11.11 29.21,12.7 29.21,16.83 35.24,22.86 35.24,24.77 33.02,26.99 30.48,26.99 30.48,33.18 30.96,33.66 30.96,33.97 30.48,34.45 30.48,35.56 30.16,35.88 27.46,35.88 26.83,35.24 25.72,33.97 20.95,28.89 13.34,28.89 7.62,23.18 6.35,23.18 9.21,20.32
  pour Bottom (isolate 0.254, no thermals): 21.59,19.37 20.95,20 19.37,20 19.05,20.32 19.05,21.91 18.1,22.86 18.1,27.3 18.73,27.94 21.59,27.94 22.86,29.21 26.67,29.21 27.3,28.57 27.3,24.77 25.08,24.77 22.86,22.54 22.86,20.32
+5V  (via drill 0.3)
  Top 0.406: v20.32,3.81 IC8.3
  Top 0.61: IC8.3 16.45,3.81 C33.1
  Route15 0.406: v40.64,33.02 41.75,31.91 41.75,20.48 39.05,17.78 39.05,4.29 37.15,2.38 32.23,2.38 30.8,3.81 v20.32,3.81 19.68,3.81 17.78,1.91 v10.16,1.91
  Bottom 0.406: v40.64,33.02 33.66,33.02 JP4.4 | C50.1 11.28,1.11 IC7.5 10,1.11 10.16,1.27 v10.16,1.91
AGND
  Bottom 0.406: JP8.10 4.38,60.1 5.24,60.96 8.89,60.96 9.05,60.8 11.75,60.8 | 11.75,60.8 IC9.2 | 11.75,60.8 13.02,62.07 13.02,63.66 13.49,64.14 IC6.14
  Bottom 0.61: IC6.14 17.62,64.14 18.1,64.61 18.52,64.61 C40.2 18.89,64.93 20.32,64.93 C41.2 20.32,66.67 20.64,66.83 SJ1.1
CAN1_RX
  Top 0.254: IC2.81 16.82,8.56 15.4,7.14 15.4,3.02 15.88,2.54 IC8.4
CAN1_TX
  Top 0.254: IC8.1 17.46,6.35 17.62,6.51 17.46,6.35 | 17.46,6.35 17.62,6.19 | 17.46,6.35 17.46,6.67 17.32,6.84 IC2.82
CAN-H  (via drill 0.3)
  Top 0.254: IC8.7 27.62,5.08 v27.94,4.76
  Bottom 0.254: v27.94,4.76 28.73,3.97 31.91,3.97 32.38,4.45 32.38,6.51 32.7,6.83 38.73,6.83 39.53,6.03 40.33,6.03 JP7.63
CAN-L  (via drill 0.3)
  Top 0.254: IC8.6 25.08,3.81 v26.19,2.7
  Bottom 0.254: v26.19,2.7 26.67,2.7 27.46,3.49 32.07,3.49 32.86,4.29 32.86,5.71 33.18,6.03 35.73,6.03 JP7.64
FLASH_CS
  Top 0.254: 3.49,24.45 3.49,24.57 2.9,24.57 2.54,24.92 2.54,26.83 2.7,26.99 3.02,26.99 3.17,27.15 3.17,30.32 3.81,30.96 3.81,32.7 3.17,33.34 3.17,36.51 2.86,36.83 1.43,36.83 1.27,36.67 IC3.4 | 3.49,24.45 3.02,24.45 3.93,23.45 IC2.58 | R29.1 3.49,24.45
FPGA_ADC0
  Bottom 0.406: JP8.7 8.7,62.1 9.21,61.59 IC6.1
FPGA_ADC1
  Bottom 0.406: JP8.8 4.79,62.1 5.71,63.02 9.05,63.02 9.21,62.87 IC6.2
FPGA_ADC2
  Bottom 0.254: 10.23,64.1 IC6.3
  Bottom 0.406: JP8.5 10.23,64.1
FPGA_ADC3
  Bottom 0.406: JP8.6 4.73,64.1 5.71,65.09 9.21,65.09 9.53,65.41 IC6.4
FPGA_ADC4
  Bottom 0.254: JP8.3 7.48,66.2
  Bottom 0.406: IC6.5 9.21,66.67 8.73,66.2 7.48,66.2
FPGA_ADC5
  Bottom 0.406: JP8.4 4.5,66.1 5.56,67.15 8.73,67.15 9.53,67.94 IC6.6
FPGA_ADC6
  Bottom 0.406: JP8.1 8.25,68.1 9.37,69.22 IC6.7
FPGA_ADC7
  Bottom 0.254: JP8.2
  Bottom 0.406: IC6.8 9.37,70.48 7.94,69.06 5.71,69.06 4.76,68.1 JP8.2
FPGA_ADC_VREF
  Bottom 0.254: JP8.9 8.51,60.1
  Bottom 0.406: 8.51,60.1 9.27,60.1 IC9.1 9.85,59.37 10.79,58.42 12.38,58.42 12.7,58.74 12.7,59.69 13.81,60.8 | 13.81,60.8 13.81,62.39 14.29,62.87 IC6.15 | R9.1 18.26,60.48 17.94,60.8 13.81,60.8
  Bottom 0.61: IC6.15 18.1,62.87 18.52,63.28 18.52,63.34 C40.1 18.73,63.34 20.16,63.34 C41.1
GND  (via drill 0.3)
  Top 0.254: 15.34,60.14 15.34,59.31 14.92,58.9 | R23.1 26.03,4.13 25.72,4.45 21.27,4.45 20.64,5.08 v19.84,5.08 | JP2.5 37.62,65.56 v37.94,65.88 | S3.P1 1.56,51.94 2.38,51.12 v3.02,51.12 | S4.P2 1.67,48.5 2.22,49.05 v3.02,49.05 | S5.P3 40.88,46.12 40.96,46.67 40.48,47.15 v39.85,47.15 | SJ4.2 8.76,61.25 9.05,60.96 11.59,60.96 11.91,61.28 v11.91,62.39 | v11.91,62.39
  Top 0.305: C5.2 31.58,19.45 IC2.10 26.67,19.45 26.6,19.53 v26.51,19.53 | IC1.29 14.44,45.55 14.61,45.72 | IC1.22 14.45,49.05 14.61,48.9 | IC1.16 14.59,52.05 14.61,52.07 | IC1.9 14.59,55.55 14.61,55.56 | 16.83,57.78 16.84,57.8 IC1.136 16.84,63.57 C12.2 | IC1.139 15.34,60.14 15.34,58.2 15.24,57.78 | 26.35,58.1 26.34,58.12 IC1.117 26.34,62.46 26.59,62.71 26.59,63.42 26.35,63.66 26.34,63.89 C11.2 | IC1.114 27.84,58.2 27.94,58.1 | IC1.101 28.75,56.05 28.57,55.88 | IC1.94 28.73,52.55 28.57,52.7 | IC1.88 28.59,49.55 28.57,49.53 | IC1.81 28.59,46.05 28.57,46.04 | IC1.42 15.34,43.4 15.24,43.81 | 16.83,43.81 16.84,43.8 IC1.45 16.84,38.19 C13.2 | IC1.67 27.84,43.4 28.26,43.81 | 26.35,43.81 26.34,43.8 IC1.64 26.34,37.85 C10.2 | 15.45,66.88 Q2.2 | C27.2 16.67,64.98 | C3.2 11.43,29.84 11.43,30 | 11.43,30 | v10,30 11.43,30 | 26.03,24.45 25.72,24.77 25.72,27.09 | v14.13,15.72 14.13,15.61 14.29,15.46 IC2.74 11.33,15.46 10.79,14.92 v10.64,14.92 10.87,14.68 10.87,12.22 11.41,11.69 11.91,11.69 | 25.72,27.09 25.72,27.15 | 25.72,27.09 25.82,26.99 IC2.27 25.82,29.95 26.19,30.32 26.51,30.32 27.62,29.21 C4.2 | C22.2 v33.81,16.99 | C1.2 27.94,13.81 28.42,14.29 | 28.42,14.29 | 28.42,14.29 28.57,14.29 30.48,14.29 30.96,13.81 30.96,13.49 C31.2 31.27,12.38 31.77,11.89 SJ2.1 | C44.2 36.99,22.86 37.78,22.07 v37.78,21.75
  Top 0.406: C2.2 11.85,11.69 11.91,11.69 | X3.5 9.86,6.52 9.84,6.03 v8.89,5.08 | 29.05,8.26 JP1.9 | 29.05,8.26 | 29.05,8.26 v29.05,6.19 33.81,6.19 34.13,6.51 | 34.13,6.51 JP1.5 | 34.13,6.51 34.45,6.19 36.35,6.19 36.67,6.51 | 36.67,6.51 JP1.3 | JP1.3 | 18.1,5.08 v19.84,5.08 | R1.1 2.86,10.16 v2.86,11.11 | 34.13,6.51 | v33.18,63.02 JP2.7 | v33.18,63.02 | JP2.1 35.88,70.64 v37.62,70.64 | JP2.3 v33.18,68.1 | v33.18,68.1 | 41.12,13.34 LED2.C 41.05,13.24 41.12,13.18 | 41.12,13.18 41.12,11.49 LED1.C 41.12,11.37 41.12,11.11 40.64,10.64 v40.64,9.21 40.64,6.67 40.16,6.19 v38.1,6.19 36.99,6.19 36.67,6.51 | 41.12,13.18 41.12,13.34 | 41.12,13.34 41.12,15.18 LED3.C 41.12,15.24 41.12,17.08 LED4.C | v14.29,26.35 14.29,26.51 13.97,26.99 12.86,28.1 11.91,28.1 11.43,28.57 11.43,29.69 | S2.P1 36.91,31.35 | JP2.9 34.13,60.48 33.81,60.8 | 33.81,60.8 | 33.81,60.8 33.66,60.96 33.66,62.71 v33.18,63.02
  Top 0.61: C29.2 C13.2 | C30.2 C10.2 | C12.2 C27.2 | C11.2 C28.2 | 15.45,66.88 16.67,65.72 16.67,64.98 | C34.2 3.33,26.19 3.81,26.67 IC3.7 3.81,30 4.45,30.64 v4.45,31.11 | IC8.2 18.1,5.08 17.14,5.08 16.61,5.61 C33.2 | S1.P3 1.67,21.67 2.22,21.11 v3.49,21.11 | C1.2 27.65,13.39 26.91,14.13 26.19,14.61 25.72,15.4 25.64,15.4 25.56,15.88 25.56,19.21 25.88,19.53 v26.51,19.53 | C31.2 v32.38,13.17 v32.38,13.18 | 11.43,30 11.43,30.01 C38.2 | JP6.1 10.16,35.08 9.37,34.29 R22.1 | 36.91,31.35 36.75,31.35 36.67,31.43 | 36.67,31.43 | 36.67,31.43 36.67,31.11 v35.56,31.11
  GND 0.813: JP6.1 11.43,35.24 JP6.4
  Bottom 0.254: JP5.SW2 15.49,7.37 15.56,7.3 15.56,7.14 | R3.1 v37.78,4.13
  Bottom 0.305: v10.64,14.92 11.59,14.92 C39.2
  Bottom 0.406: Q1.2 28.17,26.12 27.15,27.15 v26.51,27.15 | JP7.38 35.84,32.1 35.88,32.07 v33.97,32.07 32.91,31 SJ5.1 | JP7.37 40.35,32.1 40.32,32.07 v38.58,32.07 | C51.2 5.55,3.02 5.87,3.02 6.83,2.06 IC7.2 v8.1,2.06 | C50.2 13.65,1.27 13.65,3.01 C49.2 13.65,3.17 13.65,1.43 13.81,1.43 14.29,0.95 v14.76,0.95 | R2.1 16.67,29.21 15.56,29.21 15.4,29.05 14.13,27.78 14.13,26.51 v14.29,26.35 | C45.2 30.95,43.5 30.32,44.13 | 30.32,44.13 | 30.32,44.13 30,44.45 30,45.4 31.11,46.51 31.11,48.11 31.61,48.6 | 31.61,48.6 IC5.1 | IC5.1 32.22,49.52 IC1.88 | C46.2 32.19,50.68 IC1.88 | 31.61,48.6 31.91,48.9 31.91,49.27 IC1.88 | v30.8,49.53 31.89,49.53 IC5.1 | C54.2 17.94,22.07 | v8.89,5.08 9.05,5.08 10.48,6.51 10.95,6.51 11.75,7.3 11.91,7.3
  Bottom 0.61: 24.92,70.48 IC6.9 | 24.92,70.48 26.35,70.48 JP3.2 | JP5.6 19.79,17.68 19.84,17.62 v19.84,16.35 | 23.65,64.93 22.23,64.93 C42.2 22.07,66.83 SJ1.2 | 23.65,64.93 C43.2 | 23.65,64.93 23.65,67.78 24.92,69.06 24.92,70.48 | C56.2 11.75,7.62 13.18,7.62 R10.1 | R10.1 | R10.1 15.17,7.62 JP5.SW2 15.49,7.3 v16.67,7.3
  Bottom 0.813: JP8.36 JP8.35 10.29,34.1 JP6.1 | 25.4,38.1 C47.2 | 25.4,38.1 C48.2 | JP6.4 15.24,37.62 15.72,38.1 IC4.4 IC4.2 25.4,38.1 | JP6.4 | C52.- 16.51,23.81 v16.51,21.91 17.72,21.91 C54.2 C55.2 | C53.- 25.44,33.14 26.04,32.54 JP4.5 JP4.6
  other vias: 16.83,56.67 15.72,54.93 15.72,52.86 15.72,48.1 15.72,46.2 17.3,44.93 26.19,44.77 27.62,46.2 27.46,48.74 27.46,53.18 27.62,54.93 26.19,56.67 20,36.67 19.68,35.88 19.68,37.62 18.73,35.56 17.46,35.56 16.19,35.56 14.76,36.35 20,38.58 30.64,46.04
  pour Top (isolate 0.305): 13.65,26.99 14.29,27.62 26.35,27.62 26.99,26.99 26.99,14.92 26.35,14.29 14.29,14.29 13.65,14.92
  pour GND (isolate 0.254, rank 6): -1.27,73.66 27.94,73.66 27.94,70.17 33.66,70.17 33.66,73.66 43.18,73.66 43.18,-1.27 -1.27,-1.27
  pour Bottom (isolate 0.254, rank 2, no thermals): 26.04,44.45 24.77,44.45 23.81,45.4 20.32,45.4 19.37,44.45 16.51,44.45 15.24,45.72 15.24,55.88 16.51,57.15 20.64,57.15 20.95,56.83 22.54,56.83 22.86,57.15 26.67,57.15 27.94,55.88 27.94,46.35
  pour Top (isolate 0.254, rank 2): 12.38,42.23 13.02,41.59 30.16,41.59 30.8,42.23 30.8,59.37 30.16,60.01 13.02,60.01 12.38,59.37
  pour Bottom (isolate 0.254, rank 4, no thermals): 13.34,40.01 13.34,36.83 12.7,36.2 1.27,36.2 1.27,32.7 19.68,32.7 20.64,31.75 29.84,31.75 31.11,30.48 33.34,30.48 33.81,30.96 41.59,30.96 42.23,31.59 42.23,32.7 41.91,33.02 33.34,33.02 33.02,33.34 33.02,35.56 32.38,36.2 27.62,36.2 27.62,38.73 26.04,40.32 13.65,40.32
  pour Bottom (isolate 0.254, no thermals): 31.11,47.31 31.11,49.85 32.54,51.28 33.18,51.28 33.5,50.96 33.5,48.58 33.02,48.1 31.91,48.1
  pour Top (isolate 0.254): 14.29,33.66 19.68,33.66 20.64,34.61 20.64,38.1 21.59,39.05 21.59,40.01 9.53,40.01 7.62,38.1 7.62,33.34 7.94,33.02 13.65,33.02
GNDA  (via drill 0.3)
  Top 0.305: 30.96,24.45 32.36,24.45 | 32.36,24.45 SJ3.1 | 32.36,24.45 32.36,24.63 | 30.33,24.45 IC2.20 27.31,24.45 v26.67,23.81 | 30.33,24.45 31.75,25.88 32.01,25.88 C32.2 32.07,25.88 C35.2 | C35.2 | C35.2 35.82,25.88 C36.2 35.88,25.88 | 30.33,24.45 30.96,24.45 | 30.96,24.45 31.27,24.77 v31.27,25.08
  Top 0.61: 35.88,25.88 36.51,25.88 36.99,26.35 38.73,26.35 39.37,26.99 39.37,27.47 C37.2 39.37,27.78 v39.37,29.13 | v39.37,29.13 | v39.37,29.13
  Bottom 0.406: JP7.39 40.38,30.1 40.32,30.16 39.69,30.16 39.37,29.84 v39.37,29.13 | JP7.40 35.78,30.1 35.72,30.16 34.29,30.16 | 34.29,30.16 v33.97,30.48 33.66,30.16 | SJ5.2 33.13,29.64 33.66,30.16 | 33.66,30.16 34.29,30.16
  pour GND (isolate 0.254): 29.21,28.26 26.04,25.08 26.04,23.81 26.67,23.18 27.94,23.18 28.57,23.81 39.53,23.81 39.85,24.13 39.85,30 39.37,30.48 33.02,30.48 30.8,28.26
N$1  (via drill 0.3)
  Top 0.305: IC2.12 29.66,20.45 v29.84,20.64
  Bottom 0.254: v29.84,20.64 29.84,20.82 29.82,20.98 29.21,21.59 Q1.3
N$2  (via drill 0.3)
  Top 0.254: v14.45,59.37 14.29,59.37 13.34,60.32 IC1.143 | v33.34,40.48 33.34,39.85 33.61,39.58 33.66,39.58 RN4.1
  Route15 0.254: v14.45,59.37 16.03,57.78 28.1,57.78 32.38,53.5 32.38,46.99 33.97,45.4 33.97,41.12 v33.34,40.48
  Bottom 0.254: R25.1 32.23,39.69 33.02,40.48 v33.34,40.48
N$3  (via drill 0.3)
  Top 0.254: IC1.71 29.84,39.06 30.16,38.73 30.48,38.73 | 30.48,38.73 32.07,38.73 33.18,37.62 33.93,37.62 RN4.3 | v30.48,38.42 30.48,38.73
  Bottom 0.406: R7.1 29.84,39.05 v30.48,38.42
N$4  (via drill 0.3)
  Top 0.254: IC2.94 23.32,11.45 23.34,11.27 23.81,10.79 25.56,10.79 26.19,10.16 v27.62,10.16
  Route15 0.254: v33.02,3.33 33.02,4.76 v27.62,10.16
  Bottom 0.254: R3.2 33.81,4.13 v33.02,3.33
N$5  (via drill 0.3)
  Top 0.254: IC1.37 12.82,41.63 v12.7,41.75
  Route15 0.254: JP3.1 19.53,68.1 11.91,60.48 11.91,60.17 11.91,42.55 v12.7,41.75
N$6
  Top 0.254: IC1.142 13.84,62.84 13.49,63.18 10.99,63.18 SJ4.1
N$7
  Top 0.254: IC1.72 30.34,39.35 30.48,39.21 31.44,39.21 32.38,39.21 33.18,38.42 33.77,38.42 RN4.2
N$8
  Top 0.254: IC1.110 29.84,65.56 30.16,65.88 31.08,65.88 RN3.2
N$9  (via drill 0.3)
  Top 0.254: IC1.144 12.84,59.87 v13.49,59.21 | v30.96,63.5 30.96,63.98 31.11,64.14 31.11,64.25 RN3.4
  Route15 0.254: v13.49,59.21 13.49,61.12 17.46,65.09 18.73,65.09 25.72,65.09 25.88,65.09 29.37,65.09 v30.96,63.5 | v30.96,63.5 30.8,63.5 v30.96,63.5
N$10
  Top 0.254: IC1.109 30.34,64.79 30.64,65.09 31.08,65.09 RN3.3
N$11
  Top 0.254: IC1.111 29.34,66.49 29.69,66.83 RN3.1
N$12
  Top 0.254: JP2.6 39.37,65.56 38.42,66.52 33.66,66.52 33.18,66.04 32.73,66.04 RN3.7 | JP2.6
N$13
  Top 0.254: 37.78,64.45 39.37,62.87 40.32,62.87 JP2.8 | 37.78,64.45 | 37.78,64.45 37.62,64.61 33.66,64.61 33.18,65.09 32.73,65.09 RN3.6
N$14
  Top 0.254: JP2.10 38.89,60.48 38.42,60.96 38.42,63.02 37.47,63.98 33.34,63.98 33.02,64.29 32.7,64.29 RN3.5
N$15
  Top 0.254: JP2.4 39.37,68.1 38.42,67.15 32.97,67.15 RN3.8 | JP2.4
N$16
  Top 0.254: R12.2 8.1,11.27 7.46,10.64 7.46,8.88 X3.2
N$17
  Top 0.254: R13.2 9.68,11.75 9.69,11.75 R13.2 9.68,11.43 8.73,10.48 8.26,10 8.26,9.53 X3.3
N$18
  Top 0.254: R14.1 LED1.A
N$19
  Top 0.254: R15.1 LED2.A
N$20
  Top 0.254: R16.1 LED3.A
N$21
  Top 0.254: R17.1 LED4.A
N$22
  Top 0.61: LED8.C R21.2
N$23
  Top 0.61: LED7.C R20.2
N$24
  Top 0.61: LED6.C R19.2
N$25
  Top 0.61: LED5.C R18.2
N$26
  Top 0.406: LED9.C 6.67,34.45 8.1,35.88 8.26,35.88 R22.2
N$27
  Top 0.305: IC2.49 14.82,29.95 13.65,31.11 C38.1
N$28
  Top 0.305: IC2.99 25.82,11.64 26.67,10.79 27.94,10.79 28.26,10.48 29.84,10.48 30.48,11.11 SJ2.2
N$29  (via drill 0.3)
  Top 0.305: IC2.73 10.72,15.96 v10.48,15.88
  Bottom 0.305: v10.48,15.88 11.27,15.88 C39.1
N$30
  Top 0.305: IC2.19 31.29,23.95 31.91,23.34 33.18,23.34 33.81,23.97 SJ3.2
N$31
  Top 0.406: IC8.8 26.35,6.35 R23.2
N$32  (via drill 0.3)
  Top 0.254: RN5.1 24.14,69.21 v23.97,69.37
  Bottom 0.254: IC6.11 15.24,67.94 14.92,67.63 14.92,66.2 15.08,66.04 18.1,66.04 18.73,66.67 18.73,67.94 18.89,68.1 21.59,68.1 22.07,68.58 23.18,68.58 v23.97,69.37
N$33
  Top 0.406: R1.2 LED10.C
N$34
  Top 0.254: IC2.90 21.32,9 R33.1
N$36
  Top 0.305: IC2.22 29.68,25.45 31.91,27.62 | 31.91,27.62 32.38,27.62 | 32.38,27.62 32.44,27.68 C32.1 31.91,27.62 | 32.38,27.62 33.66,27.62 C35.1
  Top 0.61: C32.1 32.38,28.1 32.07,28.42 L1.2
N$37
  Bottom 0.61: IC6.16 17.46,61.59 17.94,61.91 20.64,61.91 | 20.64,61.91 21.59,61.91 22.07,62.39 22.07,63.02 | 22.07,63.02 C42.1 | 22.07,63.02 23.97,63.02 C43.1 24.13,63.03 24.45,63.02 25.24,63.82 25.24,63.98 25.24,64.61 L2.2 | R9.2 20.64,61.75 20.64,61.91
N$38  (via drill 0.3)
  Top 0.254: RN5.3 22.46,69.14 v21.91,69.69
  Bottom 0.254: IC6.13 14.76,65.41 14.45,65.72 14.45,68.26 14.76,68.58 18.1,68.58 18.57,69.06 20.95,69.06 21.43,69.53 21.75,69.53 v21.91,69.69
N$39  (via drill 0.3)
  Top 0.254: v23.02,69.53 23.18,69.37 23.18,68.14 | 23.18,68.14 23.18,68.1 | 23.18,68.14 RN5.2
  Bottom 0.254: IC6.12 17.94,66.67 18.26,66.99 18.26,68.1 18.73,68.58 21.27,68.58 21.75,69.06 22.54,69.06 v23.02,69.53
N$40
  Bottom 0.406: IC7.4 11.43,3.01 C49.1
N$41  (via drill 0.3)
  Top 0.254: RN5.4 21.59,68.74 v20.64,69.69
  Bottom 0.254: v20.64,69.69 17.78,69.69 17.3,69.22 IC6.10
N$42  (via drill 0.3)
  Top 0.406: X3.M2 3.81,2.22 | 3.81,2.22 4.76,3.17 4.76,5.71 4.13,6.35 4.13,7.34 X3.M3 | X3.M4 12.71,6.99 12.7,6.03 v12.7,4.52 12.7,2.72 X3.M1 12.53,1.59 12.06,1.59 11.43,0.95 5.08,0.95 3.81,2.22
  Bottom 0.61: C56.1 11.91,5.56 13.65,5.56 | 13.65,5.56 R10.2 | 13.65,5.56 12.7,5.47 v12.7,4.52
N$43
  Bottom 0.406: IC7.3 8.26,3.01 8.89,2.38 8.89,1.75 8.26,1.11 IC7.1 5.56,1.11 C51.1 5.4,1.11 3.03,1.11 D2.3
P1  (via drill 0.3)
  Top 0.254: IC1.1 9.51,59.55 9.21,59.85 8.26,59.85 v7.62,59.21
  Bottom 0.254: v7.62,59.21 5.71,59.21 4.6,58.1 JP8.12
P2  (via drill 0.3)
  Top 0.254: IC1.2 8.89,59.05 v8.73,59.21
  Bottom 0.254: v8.73,59.21 8.73,58.58 8.26,58.1 JP8.11
P4  (via drill 0.3)
  Top 0.254: IC1.4 6.77,58.05 v4.92,56.2
  Bottom 0.254: v4.92,56.2 2.88,56.2 JP8.14
P5  (via drill 0.3)
  Top 0.254: IC1.5 7.23,57.55 v6.67,56.99
  Bottom 0.254: 6.67,56.67 v6.67,56.99 | JP8.13 7.24,56.1 6.67,56.67 | 6.67,56.67 6.67,56.65
P6  (via drill 0.3)
  Top 0.254: IC1.6 7.68,57.05 5.71,55.09 v4.92,55.09
  Bottom 0.254: v4.92,55.09 4.6,55.09 3.65,54.13 2.81,54.13 JP8.16
P7  (via drill 0.3)
  Top 0.254: IC1.7 8.29,56.55 6.83,55.09 v6.67,55.09
  Bottom 0.254: v6.67,55.09 6.67,54.61 6.99,54.29 JP8.15
P8  (via drill 0.3)
  Top 0.254: IC1.8 8.58,56.05 6.99,54.45 4.6,54.45 v3.17,53.02
  Bottom 0.254: v3.17,53.02 3.17,52.49 JP8.18
P10  (via drill 0.3)
  Top 0.254: IC1.10 8.93,55.05 v8.89,55.09
  Bottom 0.254: v8.89,55.09 9.21,54.77 9.21,53.02 8.26,52.07 7.41,52.07 JP8.17
P11  (via drill 0.3)
  Top 0.254: IC1.11 9.46,54.55 8.89,53.98 4.76,53.98 4.29,53.5 v4.29,53.02
  Bottom 0.254: JP8.20 3.27,50.1 4.45,51.28 4.45,52.86 v4.29,53.02
P12  (via drill 0.3)
  Top 0.254: v4.92,50.64 4.92,53.34 5.08,53.5 9.05,53.5 9.6,54.05 IC1.12
  Bottom 0.254: v4.92,50.64 5.33,50.26 5.49,50.1 JP8.19
P20  (via drill 0.3)
  Top 0.254: IC1.20 8.53,50.05 7.46,51.12 | S3.P3 5.98,51.28 7.3,51.28 7.46,51.12 | 7.46,51.12 v7.78,51.12
  Bottom 0.254: v7.78,51.12 10,51.12 R8.1
P21  (via drill 0.3)
  Top 0.254: 9.46,49.55 8.23,49.55 7.78,50.01 7.14,50.01 6.19,49.05 6.19,48.63 S4.P4 | 9.46,49.55 IC1.21 | 9.46,49.55 9.46,49.27 v9.53,49.37
  Bottom 0.254: R5.1 9.68,49.21 v9.53,49.37
P23  (via drill 0.3)
  Top 0.254: IC1.23 9.23,48.55 8.73,49.05 v7.46,49.05
  Bottom 0.254: JP8.22 4.92,48.1 5.87,49.05 v7.46,49.05
P24  (via drill 0.3)
  Top 0.254: 7.57,48.05 | 7.57,48.05 7.78,48.26 8.89,48.26 9.1,48.05 IC1.24 | 7.57,48.05 6.67,47.15 v6.35,47.15
  Bottom 0.254: v6.35,47.15 6.35,47.62 6.67,47.94 7.22,47.94 JP8.21
P25  (via drill 0.3)
  Top 0.254: IC1.25 8.96,47.55 8.73,47.78 7.94,47.78 6.51,46.35 5.4,46.35 | 5.4,46.35 | v4.76,46.35 5.4,46.35
  Bottom 0.254: JP8.24 4.51,46.1 v4.76,46.35
P26  (via drill 0.3)
  Top 0.254: IC1.26 8.63,47.05 8.41,46.99 v8.26,47.15
  Bottom 0.254: JP8.23 7.38,46.27 7.78,46.2 8.26,46.67 v8.26,47.15
P27  (via drill 0.3)
  Top 0.254: IC1.27 8.93,46.55 8.26,45.88 | 8.26,45.88 | v4.76,44.93 5.71,45.88 8.26,45.88
  Bottom 0.254: v4.76,44.93 4.45,44.93 3.65,44.13 2.81,44.13 JP8.26
P28  (via drill 0.3)
  Top 0.254: IC1.28 9.06,46.05 8.1,45.09 7.94,45.09 v7.78,45.09
  Bottom 0.254: JP8.25 7.43,44.26 7.78,44.61 v7.78,45.09 | v7.78,45.09
P30  (via drill 0.3)
  Top 0.254: IC1.30 8.86,45.05 7.46,43.66 6.35,43.66 v4.92,42.23
  Bottom 0.254: JP8.28 4.79,42.1 v4.92,42.23
P31  (via drill 0.3)
  Top 0.254: IC1.31 8.99,44.55 7.46,43.02 v6.99,43.02
  Bottom 0.254: JP8.27 7.27,42.26 6.99,42.55 v6.99,43.02
P32  (via drill 0.3)
  Top 0.254: IC1.32 9.12,44.05 6.99,41.91 6.03,41.91 5.4,41.27 v5.24,41.27
  Bottom 0.254: JP8.30 3.59,40.1 4.76,41.27 v5.24,41.27
P33  (via drill 0.3)
  Top 0.254: IC1.33 9.42,43.55 7.3,41.43 6.99,41.12 v6.51,41.12
  Bottom 0.254: JP8.29 7.05,40.1 6.51,40.64 v6.51,41.12
P35  (via drill 0.3)
  Top 0.254: IC1.35 9.05,42.55 6.99,40.48 5.24,40.48 4.13,39.37 v3.81,39.05
  Bottom 0.254: JP8.32 3.33,38.1 3.81,38.58 v3.81,39.05
P36  (via drill 0.3)
  Top 0.254: IC1.36 9.35,42.05 7.46,40.16 v7.46,39.05
  Bottom 0.254: 7.46,38.89 v7.46,39.05 7.46,38.58 7.22,38.34 JP8.31
P53
  Top 0.254: 20.16,34.13
  Top 0.305: IC1.53 20.84,36.08 20.16,35.4 20.16,34.13 20.32,33.97 25.08,33.97 25.32,34.21 RN1.7
P55
  Top 0.254: IC1.55 21.84,38.19 21.43,37.78 21.43,35.72 20.8,35.08 RN2.8
P56
  Top 0.254: IC1.56 22.34,37.9 21.91,37.47 21.91,35.4 21.59,35.08 21.59,34.8 RN2.7
P58
  Top 0.254: IC1.58 23.34,38.9 23.02,38.58 23.02,37.78 22.38,37.15 22.38,35.24 22.54,35.08 22.54,34.8 RN2.6
P59
  Top 0.254: IC1.59 23.84,38.76 23.65,38.58 23.65,35.08 23.5,34.92 23.5,34.73 23.49,34.72 RN2.5
P60
  Top 0.254: IC1.60 24.34,38.63 24.13,38.42 24.13,35.4 24.29,35.24 24.29,34.8 24.36,34.72 RN1.8
P63
  Top 0.254: IC1.63 25.84,38.45 25.88,38.42 25.88,35.56 26.11,35.32 RN1.6
P65
  Top 0.254: IC1.65 26.84,39.04 27.62,38.26 27.62,35.72 26.99,35.08 RN1.5
P73  (via drill 0.3)
  Top 0.254: IC1.73 33.99,42.05 34.61,41.43 34.61,40.32 34.77,40.16 35.4,40.16 36.35,39.21 | 36.35,39.21 | 36.35,39.21 38.1,37.47 | 38.1,37.47 | 38.1,37.47 v38.58,36.99
  Bottom 0.254: v38.58,36.99 | v38.58,36.99 39.37,36.2 40.3,36.2 JP7.33
P74  (via drill 0.3)
  Top 0.254: IC1.74 34.13,42.55 35.24,41.43 v35.24,41.12
  Bottom 0.254: v35.24,41.12 34.45,41.12 33.97,40.64 33.97,36.99 34.77,36.2 35.7,36.2 JP7.34
P76  (via drill 0.3)
  Top 0.254: IC1.76 33.76,43.55 34.92,42.39 37.62,42.39 37.94,42.07 37.94,39.21 37.94,38.58 v38.42,38.1
  Bottom 0.254: JP7.31 v38.42,38.1
P77  (via drill 0.3)
  Top 0.254: IC1.77 33.9,44.05 35.08,42.86 37.78,42.86 38.1,42.55 38.26,42.39 38.42,42.23 38.42,42.07 38.42,39.37 38.58,39.21 v38.58,39.05
  Bottom 0.254: JP7.32 36.99,38.1 37.94,39.05 v38.58,39.05
P78  (via drill 0.3)
  Top 0.254: IC1.78 34.03,44.55 35.24,43.34 37.94,43.34 38.89,42.39 38.89,39.85 v39.53,39.21
  Bottom 0.254: 39.69,40.16 40.34,40.16 JP7.29 | 39.69,40.16 39.53,40.16 | v39.53,39.21 39.53,39.53 39.85,39.85 39.85,40.01 39.69,40.16
P79  (via drill 0.3)
  Top 0.254: IC1.79 34.17,45.05 35.4,43.81 38.1,43.81 39.37,42.55 39.37,41.27 v39.53,41.12
  Bottom 0.254: v39.53,41.12 37.78,41.12 36.83,40.16 35.86,40.16 JP7.30
P80  (via drill 0.3)
  Top 0.254: IC1.80 34.3,45.55 35.56,44.29 38.26,44.29 39.21,43.34 | v39.69,43.18 39.37,43.18 39.21,43.34 | 39.21,43.34
  Bottom 0.254: v39.69,43.18 39.69,42.55 39.85,42.39 40.11,42.23 JP7.27
P82  (via drill 0.3)
  Top 0.254: IC1.82 33.94,46.55 35.72,44.77 38.42,44.77 v38.42,44.93
  Bottom 0.254: v38.42,44.93 38.42,43.81 36.83,42.23 35.93,42.23 JP7.28
P83  (via drill 0.3)
  Top 0.254: IC1.83 35.5,47.05 v35.56,46.99
  Bottom 0.254: v35.56,46.99 38.42,46.99 38.73,46.67 38.73,45.56 39.21,45.09 39.21,44.61 39.53,44.29 39.69,44.13 40.37,44.13 JP7.25
P84  (via drill 0.3)
  Top 0.254: IC1.84 34.69,47.55 34.92,47.78 37.47,47.78 38.1,47.15 v38.1,45.88
  Bottom 0.254: v38.1,45.88 38.1,45.56 36.67,44.13 35.83,44.13 JP7.26
P85  (via drill 0.3)
  Top 0.254: IC1.85 34.4,48.05 34.61,48.26 37.94,48.26 v38.42,47.78
  Bottom 0.254: v38.42,47.78 39.21,46.99 39.21,46.35 39.37,46.2 40.3,46.2 JP7.23
P86  (via drill 0.3)
  Top 0.254: IC1.86 33.63,48.55 v33.97,48.9
  Bottom 0.254: v33.97,48.9 33.97,46.99 34.77,46.2 35.7,46.2 JP7.24
P87  (via drill 0.3)
  Top 0.254: IC1.87 33.17,49.05 33.66,49.53 36.99,49.53 37.47,49.05 v38.73,49.05
  Bottom 0.254: v38.73,49.05 39.53,48.26 40.24,48.26 JP7.21
P89  (via drill 0.3)
  Top 0.254: IC1.89 37.74,50.05 v37.94,49.85
  Bottom 0.254: v37.94,49.85 37.94,49.21 36.83,48.1 JP7.22
P90  (via drill 0.3)
  Top 0.254: IC1.90 38.17,50.55 v38.42,50.8
  Bottom 0.254: v38.42,50.8 38.89,50.8 39.53,50.16 40.34,50.16 JP7.19
P92  (via drill 0.3)
  Top 0.254: IC1.92 34.49,51.55 v34.92,51.2
  Bottom 0.254: v34.92,51.2 34.92,50.64 35.08,50.48 35.42,50.16 JP7.20
P93  (via drill 0.3)
  Top 0.254: IC1.93 37.76,52.05 v37.94,52.07
  Bottom 0.254: v37.94,52.07 40.37,52.07 JP7.17
P95  (via drill 0.3)
  Top 0.254: IC1.95 33.47,53.05 v33.81,52.7
  Bottom 0.254: v33.81,52.7 | v33.81,52.7 34.29,52.23 35.67,52.23 JP7.18
P96  (via drill 0.3)
  Top 0.254: IC1.96 34.4,53.55 34.92,53.02 v38.58,53.02
  Bottom 0.254: v38.58,53.02 39.53,53.98 40.27,53.98 JP7.15
P97  (via drill 0.3)
  Top 0.254: IC1.97 34.53,54.05 35.08,53.5 37.62,53.5 v37.78,53.66
  Bottom 0.254: JP7.16 37.34,54.1 v37.78,53.66
P98  (via drill 0.3)
  Top 0.254: IC1.98 34.67,54.55 34.92,54.29 37.31,54.29 37.94,54.29 v38.42,54.77
  Bottom 0.254: v38.42,54.77 39.53,55.88 40.18,55.88 JP7.13
P99  (via drill 0.3)
  Top 0.254: IC1.99 34.09,55.05 v34.29,55.24
  Bottom 0.254: v34.29,55.24 35.08,56.04 35.74,56.04 JP7.14
P100  (via drill 0.3)
  Top 0.254: IC1.100 33.48,55.55 33.97,56.04 35.4,56.04 35.72,56.36 35.72,57.78 36.04,58.1 38.42,58.1 v38.58,57.94
  Bottom 0.254: v38.58,57.94 40.24,57.94 JP7.11
P102  (via drill 0.3)
  Top 0.254: IC1.102 34.48,56.55 v35.08,57.15
  Bottom 0.254: v35.08,57.15 35.08,57.63 35.4,57.94 35.56,57.86 JP7.12
P103  (via drill 0.3)
  Top 0.254: IC1.103 34.03,57.05 35.56,58.58 38.26,58.58 v38.89,59.21
  Bottom 0.254: v38.89,59.21 38.89,59.37 39.53,60.01 40.31,60.01 JP7.9
P104  (via drill 0.3)
  Top 0.254: IC1.104 33.74,57.55 35.24,59.05 37.47,59.05 37.62,59.21 37.78,59.37 v37.94,59.37
  Bottom 0.254: v37.94,59.37 37.94,59.86 37.7,60.1 JP7.10
P105  (via drill 0.3)
  Top 0.254: IC1.105 33.44,58.05 34.45,59.05 | 34.45,59.05 | 34.45,59.05 34.92,59.53 37.15,59.53 37.78,60.17 v37.78,62.07
  Bottom 0.254: v37.78,62.07 40.37,62.07 JP7.7
P107  (via drill 0.3)
  Top 0.254: IC1.107 33.49,59.05 v33.81,59.37
  Bottom 0.254: v33.81,59.37 33.81,61.12 34.77,62.07 35.77,62.07 JP7.8
P108  (via drill 0.3)
  Top 0.254: IC1.108 32.09,59.55 32.38,59.85 32.38,61.59 v32.7,61.91
  Bottom 0.254: v32.7,61.91 33.34,61.91 34.45,63.02 38.26,63.02 39.37,64.14 40.37,64.14 JP7.5
P112  (via drill 0.3)
  Top 0.254: IC1.112 28.84,62.6 28.73,62.71 v28.57,62.87
  Bottom 0.254: v28.57,62.87 28.57,62.71 28.73,62.55 32.23,62.55 32.54,62.87 32.54,63.66 33.02,64.14 35.77,64.14 JP7.6
P113  (via drill 0.3)
  Top 0.254: IC1.113 28.34,60.4 28.57,60.17 30.8,60.17 31.91,61.28 v31.91,63.34
  Bottom 0.254: v31.91,63.34 31.91,63.82 33.34,65.25 38.73,65.25 39.53,66.04 40.34,66.04 JP7.3
P116  (via drill 0.3)
  Top 0.254: IC1.116 26.84,62.32 28.73,64.22 v28.73,64.29
  Bottom 0.254: v28.73,64.29 28.73,65.56 29.05,65.88 33.18,65.88 33.5,66.2 35.7,66.2 JP7.4
P118  (via drill 0.3)
  Top 0.254: IC1.118 25.84,60.13 v25.56,59.85
  Bottom 0.254: v25.56,59.85 25.56,60.8 27.94,63.18 27.94,66.04 28.26,66.36 33.02,66.36 33.97,67.31 38.73,67.31 39.37,67.94 40.24,67.94 JP7.1
P119  (via drill 0.3)
  Top 0.254: IC1.119 25.34,62.41 v25.88,62.94
  Bottom 0.254: v25.88,62.94 26.19,63.26 26.19,66.2 26.83,66.83 30.96,66.83 32.86,66.83 34.13,68.1 JP7.2
P122
  Top 0.254: IC1.122 23.84,63.16 23.5,63.5 23.5,65.72 24.13,66.36 24.13,66.56 RN5.8
P123
  Top 0.254: IC1.123 23.34,63.02 23.02,63.34 23.02,66.04 23.18,66.2 23.18,66.48 RN5.7
P124
  Top 0.254: IC1.124 22.84,62.88 22.54,63.18 22.54,66.48 RN5.6
P125
  Top 0.254: IC1.125 22.34,62.75 22.07,63.02 22.07,65.72 21.59,66.2 21.59,66.56 RN5.5
P127
  Top 0.305: IC1.127 21.34,62.48 20.64,63.18 20.64,65.09 19.05,66.67 Q2.3
P135
  Top 0.254: IC1.135 17.34,62.74 17.46,62.87 17.46,65.88 17.46,68.26 17.14,68.58 13.97,68.58 13.49,69.06 13.49,70.01 13.02,70.48 R21.1
  Top 0.305: R21.1 12.06,70.48
P137
  Top 0.254: IC1.137 16.34,62.4 13.81,64.93 13.81,68.1 13.34,68.58 R20.1
P140
  Top 0.254: IC1.140 14.84,63.27 13.34,64.77 13.34,65.72 13.34,66.36 13.02,66.67 R19.1
P141
  Top 0.254: IC1.141 14.34,63.13 13.49,63.98 12.86,64.61 12.7,64.77 R18.1 | R18.1
PA0  (via drill 0.3)
  Top 0.254: IC2.23 29.45,25.95 31.11,27.62 v31.11,27.78
  Route15 0.254: v39.05,25.08 38.66,24.77 36.99,24.77 33.97,27.78 v31.11,27.78
  Bottom 0.254: JP7.45 39.56,24.1 39.21,24.45 39.21,24.92 v39.05,25.08
PA1  (via drill 0.3)
  Top 0.254: IC2.24 29.31,26.45 30.16,27.3 v30.16,27.94
  Route15 0.254: 37.39,24.29 v37.62,24.05 | 37.39,24.29 | 37.39,24.29 36.67,24.29 33.97,26.99 30.96,26.99 30.16,27.78 v30.16,27.94
  Bottom 0.254: JP7.46 37.75,24.1 v37.62,24.05
PA2  (via drill 0.3)
  Top 0.254: IC2.25 29.18,26.95 29.53,27.3 29.53,27.46 29.53,27.78 29.53,27.94 29.53,28.57 v30.16,29.21
  Route15 0.254: 34.29,29.69 38.02,25.96 v38.02,25.48 | 34.29,29.69 | 34.29,29.69 30.64,29.69 v30.16,29.21 | v30.16,29.21
  Bottom 0.254: 40.1,26.1 JP7.43 40.39,26.11 39.21,26.11 39.13,26.04 39.05,26.04 38.5,25.48 38.18,25.48 v38.02,25.48
PA3  (via drill 0.3)
  Top 0.254: IC2.26 26.32,28.45 26.67,28.1 28.57,28.1 v28.73,27.94
  Route15 0.254: v28.73,27.94 29.21,27.94 29.84,28.57 32.7,28.57 33.34,28.57 v33.81,29.05
  Bottom 0.254: v33.81,29.05 33.81,27.15 34.77,26.19 35.71,26.19 JP7.44
PA8  (via drill 0.3)
  Top 0.254: IC2.67 13.4,18.95 13.81,19.37 v13.81,20 | v22.38,32.23 22.54,32.38 22.54,33.15 RN2.3
  Bottom 0.254: v13.81,20 13.81,20.64 12.06,22.38 12.06,26.51 15.4,29.84 15.88,30.32 18.26,30.32 18.41,30.48 20.64,32.7 21.91,32.7 v22.38,32.23 | v22.38,32.23
PB0  (via drill 0.3)
  Top 0.254: IC2.35 21.82,30.25 v21.59,30.48
  Bottom 0.254: JP7.53 38.35,16.1 37.47,16.99 34.77,16.99 34.13,17.62 34.13,17.78 34.13,18.26 34.13,21.11 30.64,24.61 30.64,26.83 | v21.59,30.48 21.75,30.32 22.86,30.32 27.3,30.32 | 27.3,30.32 | 27.3,30.32 28.1,29.53 28.1,27.62 28.42,27.3 30.16,27.3 30.64,26.83 | 30.64,26.83
PB1  (via drill 0.3)
  Top 0.254: IC2.36 21.32,27.73 v21.43,27.62
  Bottom 0.254: JP7.54 33.27,16.1 32.86,16.51 32.86,17.46 33.66,18.26 33.66,20.95 30.16,24.45 30.16,26.67 30,26.83 28.26,26.83 27.62,27.46 27.62,29.37 27.15,29.84 21.75,29.84 21.43,29.53 21.43,27.78 v21.43,27.62
PB2  (via drill 0.3)
  Top 0.254: IC2.37 20.82,31.61 21.11,31.91 | 21.11,31.91 21.59,32.38 21.59,33.15 RN2.2 | v21.11,32.07 21.11,31.91
  Bottom 0.254: v21.11,32.07 20.8,32.07 19.21,30.48 R2.2
PB4  (via drill 0.3)
  Top 0.254: R33.2 24.61,8.26 v25.08,7.78
  Bottom 0.254: v25.08,7.78 28.26,7.78 29.37,8.89 38.26,8.89 39.53,10.16 40.34,10.16 JP7.59
PB5  (via drill 0.3)
  Top 0.254: IC2.91 21.82,10.88 23.34,9.37 24.92,9.37 25.24,9.05 v25.24,8.73
  Bottom 0.254: v25.24,8.73 25.72,8.26 28.1,8.26 29.21,9.37 34.13,9.37 34.77,10 35.7,10 JP7.60
PB6  (via drill 0.3)
  Top 0.254: IC2.92 22.32,11.02 23.5,9.84 25.24,9.84 25.72,9.37 25.88,9.21 v26.19,8.89
  Bottom 0.254: v26.19,8.89 28.1,8.89 28.89,9.68 29.05,9.84 32.7,9.84 33.97,11.11 38.42,11.11 39.37,12.06 40.37,12.06 JP7.57
PB7  (via drill 0.3)
  Top 0.254: IC2.93 22.82,11.15 23.65,10.32 25.4,10.32 26.04,9.68 | 26.04,9.68 | 26.04,9.68 26.19,9.53 v26.99,9.53
  Bottom 0.254: v26.99,9.53 28.1,9.53 28.73,10.16 | 28.73,10.16 | 28.73,10.16 28.89,10.32 32.54,10.32 34.29,12.06 35.77,12.06 JP7.58
PB8  (via drill 0.3)
  Top 0.254: IC2.95 23.82,11.9 v24.29,11.43
  Bottom 0.254: v24.29,11.43 24.92,10.79 26.67,10.79 27.78,11.91 31.43,11.91 32.86,11.91 33.5,12.54 33.5,13.18 33.5,13.34 33.5,14.61 33.81,14.92 38.42,14.92 39.21,14.13 40.37,14.13 JP7.55
PB9  (via drill 0.3)
  Top 0.254: IC2.96 24.32,14.1 v24.29,14.29
  Bottom 0.254: 35.77,14.13 JP7.56 35.67,13.97 34.45,13.97 33.97,13.49 33.97,12.38 33.02,11.43 27.94,11.43 26.83,10.32 24.45,10.32 23.65,11.11 23.65,13.97 23.97,14.29 v24.29,14.29
PB10  (via drill 0.3)
  Top 0.254: v14.53,31.27 14.76,31.43 15.24,31.43 15.82,30.85 IC2.47
  Route15 0.254: v4.76,24.61 4.76,25.56 7.14,27.94 8.57,27.94 9.68,29.05 11.27,29.05 13.34,31.11 14.29,31.11 v14.53,31.27
  Bottom 0.254: JP8.46 3.78,24.1 4.29,24.61 v4.76,24.61
PB11  (via drill 0.3)